# Altium schematic sheet LDO & USB.SchDoc: Smart Nursery Guardian
size A; DrawnBy: Tharaa Mohamed; Revision: V1.0; SheetNumber: 1; SheetTotal: 2
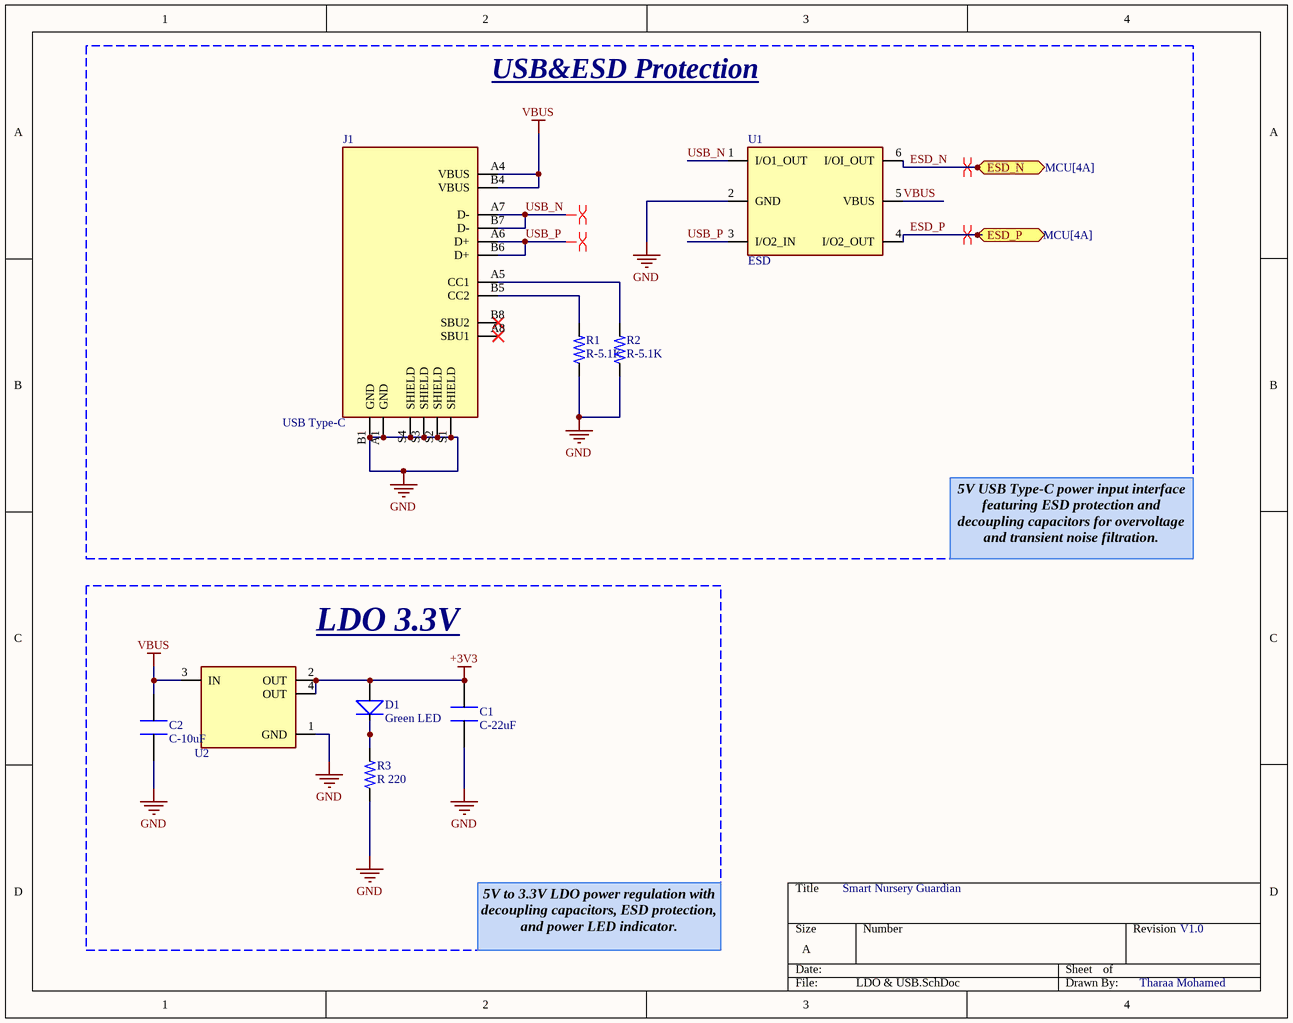
[diagram p0: LDO & USB.SchDoc]

## Parts
C1  C-22uF  [C-22uF]
C2  C-10uF  [C-10uF]
D1  Green LED  [Green LED]
J1  USB Type-C  [USB_Type-C]
R1  R-5.1K  [R-5.1K]
R2  R-5.1K  [R-5.1K]
R3  R 220  [R-220]
U1  ESD  [ESD]
U2  LDO 3.3  [LDO 3.3]  (value not drawn)

## Blocks framed on the sheet
USB&ESD Protection: J1 R1 R2 U1
LDO 3.3V: C1 C2 D1 R3 U2

## Ports
ESD_N (bidir, see MCU[4A]), ESD_P (bidir, see MCU[4A])

## Nets
+3V3: C1.2 D1.2 U2.2(OUT) U2.4(OUT)
GND: C1.1 C2.1 J1.A1(GND) J1.B1(GND) J1.S1(SHIELD) J1.S2(SHIELD) J1.S3(SHIELD) J1.S4(SHIELD) R1.1 R2.1 R3.1 U1.2(GND) U2.1(GND)
VBUS: C2.2 J1.A4(VBUS) J1.B4(VBUS) U1.5(VBUS) U2.3(IN)
ESD_N: U1.6(I/OI_OUT) ; port ESD_N
ESD_P: U1.4(I/O2_OUT) ; port ESD_P
USB_N: J1.A7(D-) J1.B7(D-) U1.1(I/O1_OUT)
USB_P: J1.A6(D+) J1.B6(D+) U1.3(I/O2_IN)
NetD1_1: D1.1 R3.2
NetJ1_A5: J1.A5(CC1) R2.2
NetJ1_B5: J1.B5(CC2) R1.2

Not connected (* = marked no-connect by the designer): J1 A8(SBU1)* B8(SBU2)*

## Layout directives
differential pair: ESD_N, ESD_P, USB_N, USB_P

## Notes on the sheet
- 5V USB Type-C power input interface featuring ESD protection and decoupling capacitors for overvoltage and transient noise filtration.
- 5V to 3.3V LDO power regulation with decoupling capacitors, ESD protection, and power LED indicator.

## Library data of the parts
C1 = C-22uF: MFR: muRata; MJFR PART #: GRM21BR61E226ME44L; SUPPLIER: LCSC; SUPPLIER PART #: C86816; ComponentLink1Description: New link; ComponentLink1URL: *; ComponentLink2Description: New link 1; ComponentLink2URL: https://www.lcsc.com/product-detail/C86816.html?s_z=n_q_t_Capacitor%252022uf&spm=wm.fly.bg.0.cbh___wm.ssy.tc.0.tz&lcsc_vid=QgVYVVJWE1VfXwZQRQQNBFIETgIPBFxQQFYPXlAFEgMxVlNeQFVeXlFSR1laVzsOAxUeFF5JWBYZEEoKFBINSQcJGk4eFQsCAgIaSgADAwAHC0slRlJbX1FIHxUDCw%3D%3D
C2 = C-10uF: MFR: Samsung Electro-Mechanics; MFR PART #: CL31A106KBHNNNE; SUPPLIER: LCSC; SUPPLIER PART #: C13585; ComponentLink1Description: New link; ComponentLink1URL: https://www.lcsc.com/product-detail/C13585.html?s_z=n_q_t_Capacitor%252010u&spm=wm.fly.bg.0.cbh___wm.ssy.tc.0.tz&lcsc_vid=QgVYVVJWE1VfXwZQRQQNBFIETgIPBFxQQFYPXlAFEgMxVlNeQFVeXldRQVBdXjsOAxUeFF5JWBYZEEoKFBINSQcJGk4dAgUUFAk%3D
D1 = Green LED: MFR: NATIONSTAR; MFR PART #: NATIONSTAR; SUPPLIER: LCSC; SUPPLIER PART #: C84260; ComponentLink1Description: New link; ComponentLink1URL: https://www.lcsc.com/product-detail/C84260.html?s_z=n_q_t_Green%2520led&spm=wm.fly.bg.0.cbh___wm.ssy.tc.0.tz&lcsc_vid=QgVYVVJWE1VfXwZQRQQNBFIETgIPBFxQQFYPXlAFEgMxVlNeQFVcUVVXTlJaUzsOAxUeFF5JWBYZEEoKFBINSQcJGk4eFQsCAgIaSgADAwAHC0slRlJbX1FIHxUDCw%3D%3D
J1 = USB Type-C: MFR: Korean Hroparts Elec; MFR PART #: TYPE-C-31-M-12; SUPPLIER: LCSC; SUPPLIER PART #: C165948; ComponentLink1Description: New link; ComponentLink1URL: https://www.lcsc.com/product-detail/C165948.html?s_z=n_q_p_USB%2520type%2520c&spm=wm.ssy.bg.1.cbh&lcsc_vid=QgVYVVJWE1VfXwZQRQQNBFIETgIPBFxQQFYPXlAFEgMxVlNeQFVeVFZQRVNcVjsOAxUeFF5JWBYZEEoKFBINSQcJGk4eFQsCAgIaSgADAwAHC0slRVBWVFBeRE8GEwkK
R1 R2 = R-5.1K: MFR: YAGEO; MFR PART #: RC0402FR-075K1L; SUPPLIER: LCSC; SUPPLIER PART #: C105872; ComponentLink1Description: New link; ComponentLink1URL: https://www.lcsc.com/product-detail/C105872.html?s_z=n_q_p_Resistance%25205.1K&spm=wm.ssy.bg.0.cbh&lcsc_vid=QgVYVVJWE1VfXwZQRQQNBFIETgIPBFxQQFYPXlAFEgMxVlNeQFVeU1NTRFFbUTsOAxUeFF5JWBYZEEoKFBINSQcJGk4NBhADEA4cHktXRlVcSQwSGg0%3D
R3 = R 220: MFR: UNI-ROYAL; MFR PART #: 0603WAF2200T5E; SUPPLIER: LCSC; SUPPLIER PART #: C22962; ComponentLink1Description: New link; ComponentLink1URL: https://www.lcsc.com/product-detail/C22962.html?s_z=n_q_t_Resistor%2520220&spm=wm.fly.bg.0.cbh___wm.ssy.tc.0.tz&lcsc_vid=QgVYVVJWE1VfXwZQRQQNBFIETgIPBFxQQFYPXlAFEgMxVlNeQFVcUVFXRFlbXjsOAxUeFF5JWBYZEEoKFBINSQcJGk4dAgUUFAk%3D
U1 = ESD: MFR: ST; MFR PART #: USBLC6-2SC6; SUPPLIER: LCSC; SUPPLIER PART #: C7519; ComponentLink1Description: New link; ComponentLink1URL: https://www.lcsc.com/product-detail/C7519.html?s_z=n_q_USBLC62SC6&spm=wm.fly.bg.0.xh&lcsc_vid=R1MIBQFWRANZAVdREQcIVV1fQVhaBlMEQwUKAQJQE1IxVlNeQFVeUldeRFBeVDsOAxUeFF5JWBYZEEoKFBINSQcJGk4dAgUUFAk%3D
U2 = LDO 3.3: MFR: Advanced Monolithic Systems; MFR PART #: LTC1844ES5-3.3#TRMPBF; MFR PART: AMS1117-3.3; Suplier: LCSC; SUPPLIER: LCSC; SUPPLIER PART #: C580445; ComponentLink1Description: New link; ComponentLink1URL: https://www.lcsc.com/product-detail/C6186.html?s_z=n_q_AMS1117-3.3&spm=wm.fly.bg.0.cbh&lcsc_vid=QgVYVVJWE1VfXwZQRQQNBFIETgIPBFxQQFYPXlAFEgMxVlNeQFVeX1FTTlFbVzsOAxUeFF5JWBYZEEoKFBINSQcJGk4NBhADEA4cHktXR1JcSQwSGg0%3D; SUPPLIER PART: C6186